# EAGLE design MineSwipper Main_controller_USB (EAGLE 8.5.1)

## Sheet 1 of 3: Arduino and Bluetooth
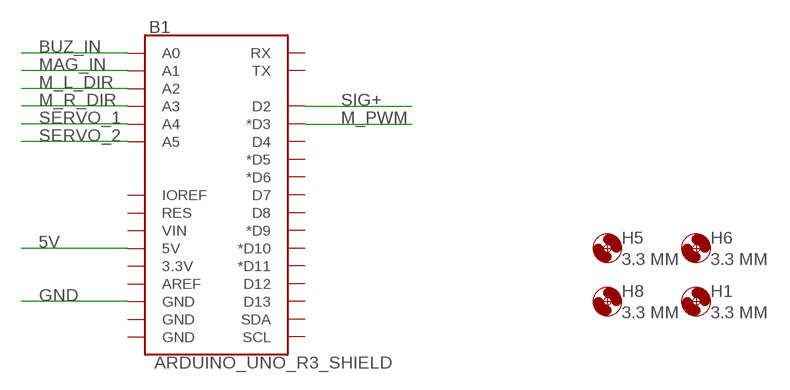
[diagram p0: schematic, sheet 1]

### Parts
B1  ARDUINO_UNO_R3_SHIELD  ARDUINO_UNO_R3_SHIELDUNO_R3_SHIELD_NOLABELS_LOCK  [UNO_R3_SHIELD_NOLABELS_LOCK]
H1  3.3 MM  MOUNT-HOLE3.3  [3,3]
H5  3.3 MM  MOUNT-HOLE3.3  [3,3]
H6  3.3 MM  MOUNT-HOLE3.3  [3,3]
H8  3.3 MM  MOUNT-HOLE3.3  [3,3]

### Nets
5V: B1.5V ; also sheet 2
BUZ_IN: B1.A0 ; also sheet 3
GND: B1.GND@2(GND) ; also sheet 2,3
M_L_DIR: B1.A2 ; also sheet 2
M_PWM: B1.D3(*D3) ; also sheet 2
M_R_DIR: B1.A3 ; also sheet 2
MAG_IN: B1.A1 ; also sheet 3
SERVO_1: B1.A4 ; also sheet 2
SERVO_2: B1.A5 ; also sheet 2
SIG+: B1.D2 ; also sheet 2
Unconnected: B1.3.3V B1.AREF B1.D4 B1.D5(*D5) B1.D6(*D6) B1.D7 B1.D8 B1.D9(*D9) B1.D10(*D10) B1.D11(*D11) B1.D12 B1.D13 B1.GND@0(GND) B1.GND@1(GND) B1.IOREF B1.RES B1.RX B1.SCL B1.SDA B1.TX B1.VIN

## Sheet 2 of 3: Terminals
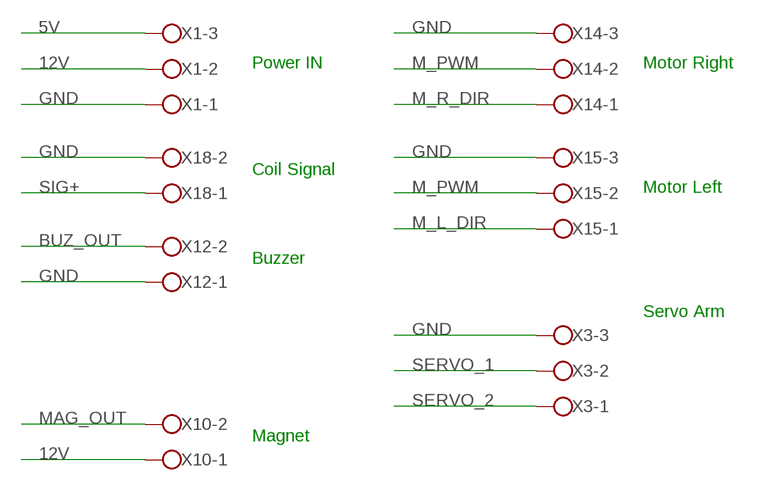
[diagram p1: schematic, sheet 2]

### Parts
X1  W237-103  [W237-103]
X3  W237-103  [W237-103]
X10  W237-102  [W237-102]
X12  W237-102  [W237-102]
X14  W237-103  [W237-103]
X15  W237-103  [W237-103]
X18  W237-102  [W237-102]

### Nets
5V: X1.3 ; also sheet 1
12V: X1.2 X10.1 ; also sheet 3
BUZ_OUT: X12.2 ; also sheet 3
GND: X1.1 X3.3 X12.1 X14.3 X15.3 X18.2 ; also sheet 1,3
M_L_DIR: X15.1 ; also sheet 1
M_PWM: X14.2 X15.2 ; also sheet 1
M_R_DIR: X14.1 ; also sheet 1
MAG_OUT: X10.2 ; also sheet 3
SERVO_1: X3.2 ; also sheet 1
SERVO_2: X3.1 ; also sheet 1
SIG+: X18.1 ; also sheet 1

### Notes on the sheet
- Power IN | Motor Right
- Coil Signal
- Motor Left
- Buzzer
- Servo Arm
- Magnet

## Sheet 3 of 3: BUZZER ON/OFF
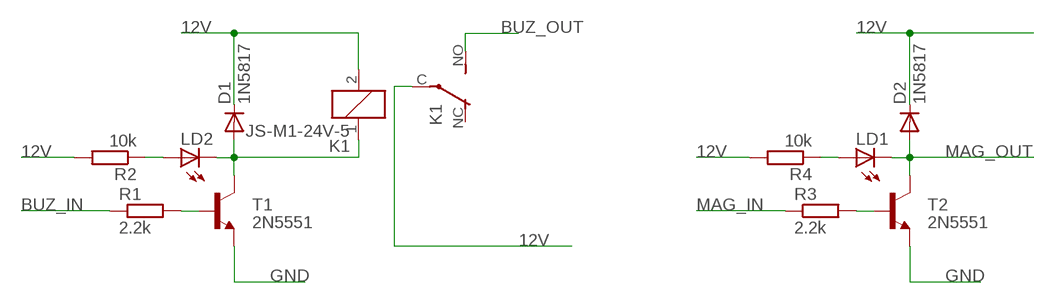
[diagram p2: schematic, sheet 3]

### Parts
D1  1N5817  1N4004  [DO41-10]
D2  1N5817  1N4004  [DO41-10]
K1  JS-M1-24V-5  JS-M1-12V-5  [JS-M]
LD1  LED5MM  [LED5MM]
LD2  LED5MM  [LED5MM]
R1  2.2k  R-EU_0207/10  [0207/10]
R2  10k  R-EU_0207/10  [0207/10]
R3  2.2k  R-EU_0207/10  [0207/10]
R4  10k  R-EU_0207/10  [0207/10]
T1  2N5551  2N2222  [TO92-EBC-OVAL]
T2  2N5551  2N2222  [TO92-EBC-OVAL]

### Nets
12V: D1.C D2.C K1.2 K1.C(2:P) R2.2 R4.2 ; also sheet 2
BUZ_IN: R1.1 ; also sheet 1
BUZ_OUT: K1.NO(2:S) ; also sheet 2
GND: T1.E T2.E ; also sheet 1,2
MAG_IN: R3.1 ; also sheet 1
MAG_OUT: D2.A LD1.K(C) T2.C ; also sheet 2
N$2: R3.2 T2.B
N$3: LD1.A R4.1
N$51: D1.A K1.1 LD2.K(C) T1.C
N$52: R1.2 T1.B
N$53: LD2.A R2.1
Unconnected: K1.NC(2:O)

## Library data of the parts
B1 = SparkFun-Boards:ARDUINO_UNO_R3_SHIELD: Arduino R3 Shield Footprint Shield form compatible with the Arduino Uno R3. SparkFun Products: MG2639 Cellular Shield <https://www.sparkfun.com/products/13120> MIDI Shield <https://www.sparkfun.com/products/12898> R3 Stackable Headers Kit <https://www.sparkfun.com/products/11417>
D1 D2 = adafruit:1N4004: DIODE General purpose 1N400x type rectifier (With bigger pads) http://www.ladyada.net/library/pcb/eaglelibrary.html
H1 H5 H6 H8 = holes:MOUNT-HOLE: MOUNTING HOLE with drill center marker
K1 = relay:JS-M1*: Automotive Ultra-Miniature Power Relay NAiS Source: http://www.mew-europe.com/.. en_ds_61211_0000.pdf; MF: FARNELL; MPN: JSM1-12V-5; OC_FARNELL: 910351; OC_NEWARK: 14J1764
LD1 LD2 = led:LED: LED OSRAM: - CHIPLED LG R971, LG N971, LY N971, LG Q971, LY Q971, LO R971, LY R971 LH N974, LH R974 LS Q976, LO Q976, LY Q976 LO Q996 - Hyper CHIPLED LW Q18S LB Q993, LB Q99A, LB R99A - SideLED LS A670, LO A670, LY A670, LG A670, LP A670 LB A673, LV A673, LT A673, LW A673 LH A674 LY A675 LS A676, LA A676, LO A676, LY A676, LW A676 LS A679, LY A679, LG A679 - Hyper Micro SIDELED® LS Y876, LA Y876, LO Y876, LY Y876 LT Y87S - SmartLED LW L88C, LW L88S LB L89C, LB L89S, LG L890 LS L89K, LO L89K, LY L89K LS L896, LA L896, LO L896, LY L896 - TOPLED LS T670, LO T670, LY T670, LG T670, LP T670 LSG T670, LSP T670, LSY T670, LOP T670, LYG T670 LG T671, LOG T671, LSG T671 LB T673, LV T673, LT T673, LW T673 LH T674 LS T676, LA T676, LO T676, LY T676, LB T676, LH T676, LSB T676, LW T676 LB T67C, LV T67C, LT T67C, LS T67K, LO T67K, LY T67K, LW E67C LS E67B, LA E67B, LO E67B, LY E67B, LB E67C, LV E67C, LT E67C LW T67C LS T679, LY T679, LG T679 LS T770, LO T770, LY T770, LG T770, LP T770 LB T773, LV T773, LT T773, LW T773 LH T774 LS E675, LA E675, LY E675, LS T675 LS T776, LA T776, LO T776, LY T776, LB T776 LHGB T686 LT T68C, LB T68C - Hyper Mini TOPLED® LB M676 - Mini TOPLED Santana® LG M470 LS M47K, LO M47K, LY M47K Source: http://www.osram.convergy.de/
R1-R4 = rcl-2:R-EU_: RESISTOR, European symbol
T1 T2 = adafruit:2N2222: NPN TRANSISTOR Big oval pads
X1 X3 X14 X15 = con-wago-500:W237-103: WAGO SCREW CLAMP; MPN: 237-103; OC_FARNELL: unknown; OC_NEWARK: 18M7116
X10 X12 X18 = con-wago-500:W237-102: WAGO SCREW CLAMP; MPN: 237-102; OC_FARNELL: unknown; OC_NEWARK: 70K9898

## Board
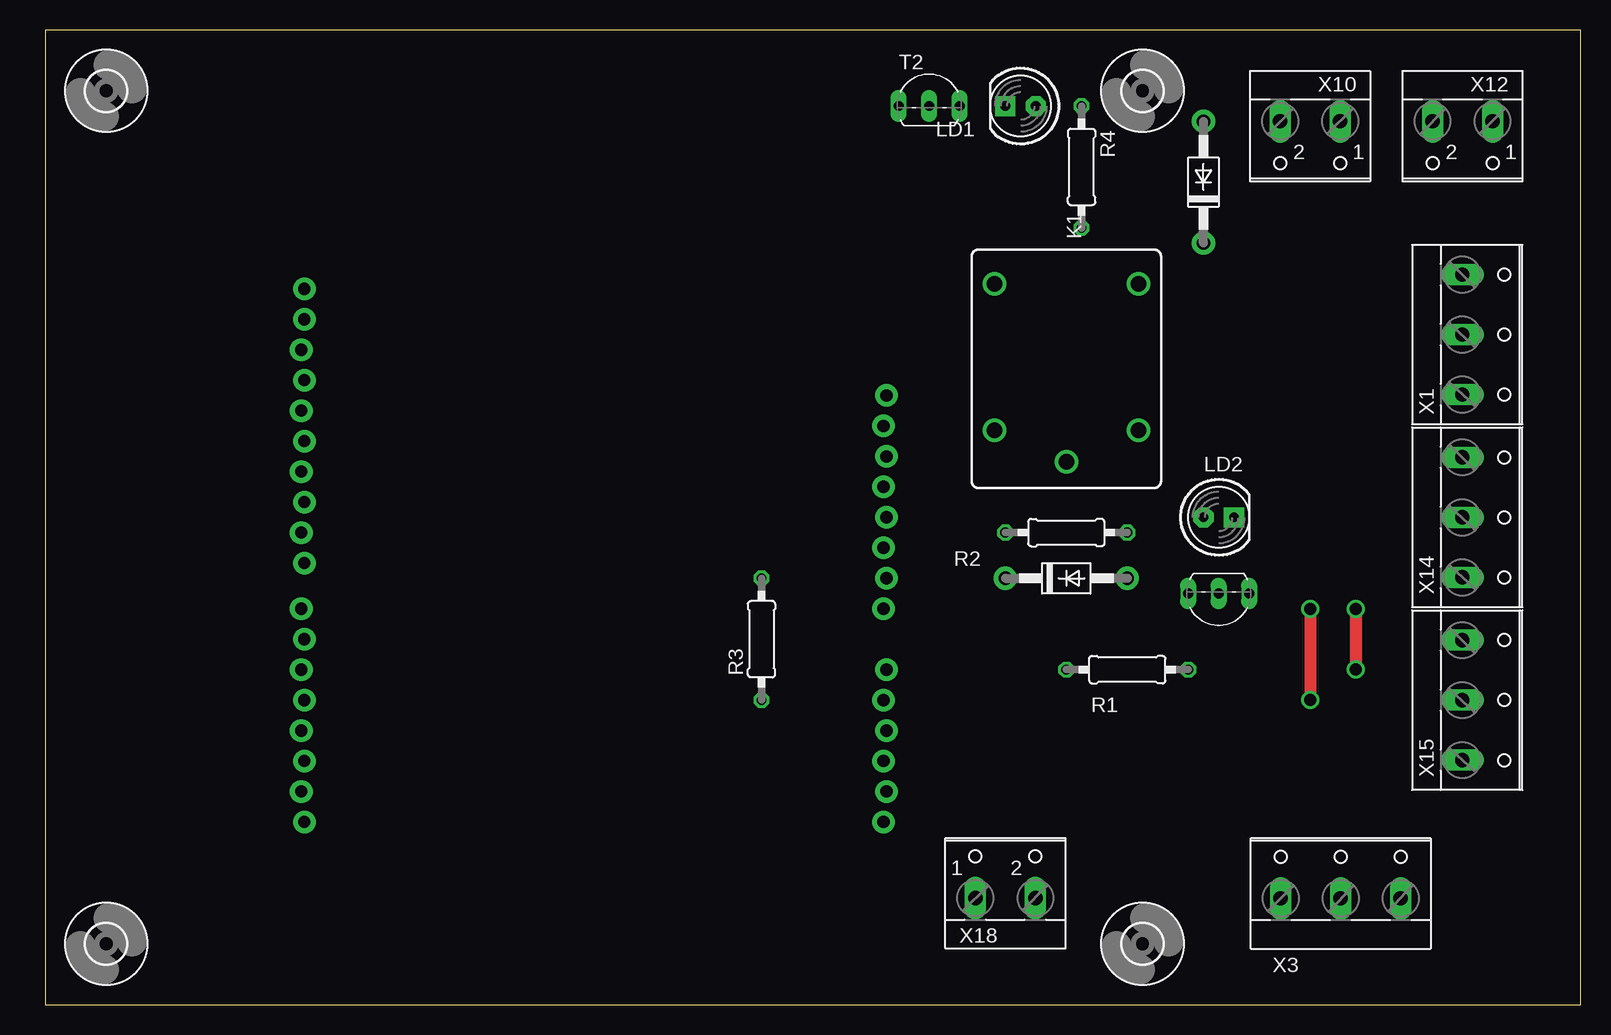
[diagram p3: board, top side]
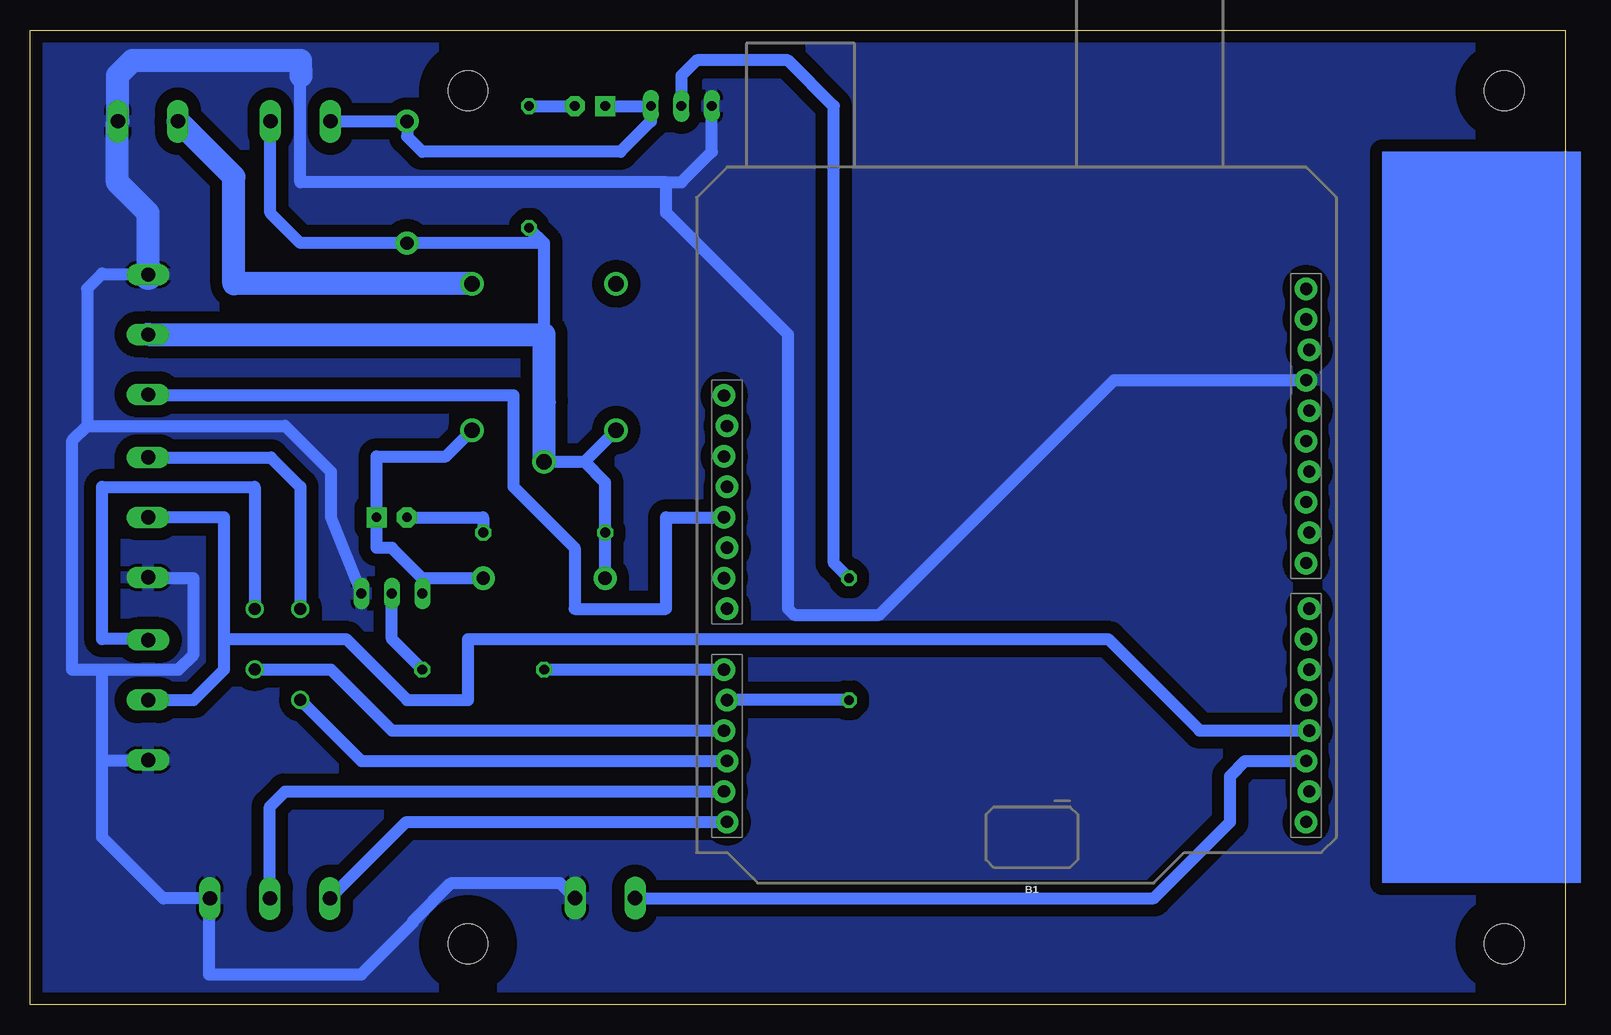
[diagram p4: board, bottom side, seen from below]

Size 127.94 x 81.27 mm. Coordinates in mm from the lower left corner, seen from the top.
Outline: 0,0 127.94,0 127.94,81.27 0,81.27 0,0
Copper layers (1*16): Top 0.035mm / dielectric 1.5mm / Bottom 0.035mm
Design rules "default *": minimum track width 6mil, minimum drill 0.35mm, track to track 40mil, track to pad 40mil, pad to pad 6mil, via to via 6mil, smd to smd 6mil, copper to edge 40mil, drill to drill 6mil, minimum pad ring 10mil, minimum via ring 8mil, stop-mask expansion 4mil, vias tented up to drill 0mil, thermal gap 10mil

### Footprints (pad centres in the part's own frame; a part is rotated, then mirrored left to right if it is on the bottom)
UNO_R3_SHIELD_NOLABELS_LOCK = drill 1.016 pad 1.88: 3.3V 24.13,-3.81; 5V 24.384,-1.27; A0 24.384,11.43; A1 24.13,13.97; A2 24.384,16.51; A3 24.13,19.05; A4 24.384,21.59; A5 24.13,24.13; AREF -24.384,-15.24; D2 -24.13,19.05; D3 -24.384,16.51; D4 -24.13,13.97; D5 -24.384,11.43; D6 -24.13,8.89; D7 -24.384,6.35; D8 -24.13,2.54; D9 -24.384,0; D10 -24.13,-2.54; D11 -24.384,-5.08; D12 -24.13,-7.62; D13 -24.384,-10.16; GND@0 24.13,1.27; GND@1 24.384,3.81; GND@2 -24.13,-12.7; IOREF 24.13,-8.89; NC 24.384,-11.43; RES 24.384,-6.35; RX -24.13,24.13; SCL -24.13,-20.32; SDA -24.13,-17.78; TX -24.384,21.59; VIN 24.13,6.35
DO41-10 = drill 1.118 pad 1.93: A 5.08,0; C -5.08,0
3,3 = hole 3.3: 0,0
JS-M = drill 1.3: 1 6.7,6; 2 6.7,-6; C 9.335,0; NC -5.5,-6; NO -5.5,6
LED5MM = drill 0.813 pad 1.676 octagon: A -1.27,0 | drill 0.813 pad 1.676 square: K 1.27,0
0207/10 = drill 0.813 octagon: 1 -5.08,0; 2 5.08,0
TO92-EBC-OVAL = drill 0.813 long: B 0,-1.27; C 2.54,-1.27; E -2.54,-1.27
W237-103 = drill 1.194 long: 1 -5,-1.29; 2 0,-1.29; 3 5,-1.29
W237-102 = drill 1.194 long: 1 -2.5,-1.27; 2 2.5,-1.27

### Placement (x,y rotation side)
B1  45.72,39.37 180 bottom
D1  85.09,35.56 0 top
D2  96.52,68.58 90 top
H1  5.08,76.2 0 top
H5  5.08,5.08 0 top
H6  91.44,76.2 0 top
H8  91.44,5.08 0 top
K1  85.09,54.61 270 top
LD1  81.28,74.93 180 top
LD2  97.79,40.64 0 top
R1  90.17,27.94 0 top
R2  85.09,39.37 180 top
R3  59.69,30.48 90 top
R4  86.36,69.85 270 top
T1  97.79,33.02 180 top
T2  73.66,76.2 0 top
X1  119.38,55.88 270 top
X3  107.95,10.16 0 top
X10  105.41,72.39 180 top
X12  118.11,72.39 180 top
X14  119.38,40.64 270 top
X15  119.38,25.4 270 top
X18  80.01,10.16 0 top

### Tracks (layer width: path | path; a pad name or v marks a point on that pad's centre or on a via)
5V
  Bottom 1.016: B1.5V 74.93,40.64 74.93,33.02 82.55,33.02 82.55,38.1 87.63,43.18 87.63,50.8 118.01,50.8 X1.3
12V
  Bottom 1.016: D1.C R2.2 80.01,43.56 81.73,45.27 | 84.64,50.35 K1.C 81.73,45.27 | 81.73,45.27 K1.2 | 85.09,55.88 85.09,63.5 | 85.09,63.5 D2.C 105.41,63.5 107.91,66 X10.1 | R4.2 85.09,63.5
  Bottom 1.905: X1.2 85.09,55.88 K1.C
BUZ_IN
  Bottom 1.016: R1.1 B1.A0
BUZ_OUT
  Bottom 1.905: X12.2 115.57,73.66 110.95,69.04 110.95,60.11 K1.NO
GND
  Bottom 1.016: 105.41,78.74 105.41,68.58 74.93,68.58 | X1.1 121.84,60.88 121.92,60.96 123.19,59.69 123.19,48.26 | 123.19,48.26 106.68,48.26 102.87,44.45 102.87,40.64 T1.E | X15.3 118.17,20.32 121.92,20.32 | 121.92,20.32 121.92,27.94 | 121.92,27.94 115.57,27.94 114.3,29.21 114.3,35.56 118.01,35.56 X14.3 | 123.19,48.26 124.46,46.99 124.46,27.94 121.92,27.94 | 121.92,20.32 121.92,13.97 116.82,8.87 X3.3 113.03,8.79 113.03,2.54 100.33,2.54 96.01,6.86 96.01,6.97 92.83,10.16 83.78,10.16 X18.2 | 74.93,68.58 73.66,68.58 71.12,71.12 T2.E | B1.GND@2 37.59,52.07 57.15,32.51 64.26,32.51 64.77,33.02 64.77,55.88 74.93,66.04 74.93,68.58
  Bottom 1.905: 105.37,77.43 105.41,78.74 119.38,78.74 120.65,77.47 120.61,77.43 X12.1 120.65,73.62 120.65,68.58 118.09,66.02 X1.1
  Bottom 2.54: X1.1 118.01,60.96 118.11,60.96
  pour Bottom: 1.27,80.01 128.27,80.01 129.54,81.28 129.54,1.27 128.27,0 1.27,0 1.27,78.74
M_L_DIR  (via drill 1)
  Top 1.016: v109.22,33.02 v109.22,27.94
  Bottom 1.016: X15.1 118.17,30.48 121.92,30.48 121.92,43.18 109.22,43.18 v109.22,33.02 | v109.22,27.94 102.87,27.94 97.79,22.86 B1.A2
M_PWM
  Bottom 1.016: X15.2 114.3,25.4 111.76,27.94 111.76,30.48 | 111.76,30.48 111.76,40.64 X14.2 | 111.76,30.48 101.6,30.48 96.52,25.4 91.44,25.4 91.44,30.48 38.1,30.48 30.48,22.86 B1.D3
M_R_DIR  (via drill 1)
  Top 1.016: v105.41,33.02 v105.41,25.4
  Bottom 1.016: X14.1 107.87,45.64 105.41,43.18 v105.41,33.02 | B1.A3 100.33,20.32 v105.41,25.4
MAG_IN  (via drill 0.35)
  Bottom 1.016: R3.1 B1.A1
  other vias: 59.69,25.4
MAG_OUT
  Bottom 1.016: X10.2 D2.A 96.52,72.39 95.25,71.12 78.74,71.12 76.2,73.66 T2.C LD1.K
N$2
  Bottom 1.016: R3.2 60.96,36.83 60.96,74.93 64.77,78.74 72.39,78.74 73.66,77.47 T2.B
N$3
  Bottom 1.016: R4.1 LD1.A
N$51
  Bottom 1.016: K1.1 93.28,45.72 99.06,45.72 LD2.K 99.06,38.1 97.79,38.1 95.25,35.56 | 95.25,35.56 T1.C | D1.A 95.25,35.56
N$52
  Bottom 1.016: R1.2 97.79,30.48 T1.B
N$53
  Bottom 1.016: LD2.A 90.17,40.64 R2.1
SERVO_1
  Bottom 1.016: X3.2 107.95,16.51 106.68,17.78 B1.A4
SERVO_2
  Bottom 1.016: X3.1 96.58,15.24 B1.A5
SIG+
  Bottom 1.016: X18.1 34.29,8.89 27.94,15.24 27.94,19.05 26.67,20.32 B1.D2
(copper drawn outside any net)
  shapes: Bottom area x1

### Text on the board
tDocu: + | - | + | - | MAGNET | BUZZER | DISCOVERY / MINESWEEPER | 5 | 12 | G | G | P | D | M Right | G | P | D | M Left | S ARM2 | S ARM1 | COIL SIG+ | COIL SIG-